# Altium project INVERTER_USE_555_IC.PrjPcb
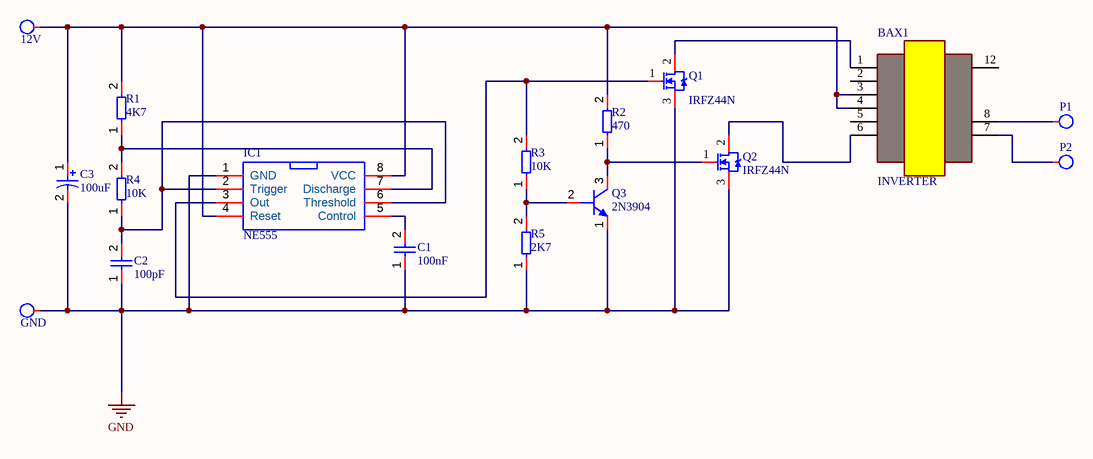
[diagram p0: INVERTER_USE_555_IC.SchDoc]
1 sheet, 17 parts. Net scope: global (net labels, ports and power ports of the same name join across sheets).
Board file: INVERTER_USE_555_IC.PcbDoc

## Sheet INVERTER_USE_555_IC.SchDoc
size A4; SheetNumber: 1; SheetTotal: 1

### Parts
12V  SolderPoint  [SolderPoint]  (value not drawn)
BAX1  INVERTER  [BAX_INVERTER]
C1  100nF  [CAP_Ceramic_Disc_2]
C2  100pF  [CAP_Ceramic_Disc_2]
C3  100uF  [CAP_RAD_5mm]
GND  SolderPoint  [SolderPoint]  (value not drawn)
IC1  NE555  [N08E_TEX]
P1  SolderPoint  [SolderPoint]  (value not drawn)
P2  SolderPoint  [SolderPoint]  (value not drawn)
Q1  IRFZ44N  [TO-220A]
Q2  IRFZ44N  [TO-220A]
Q3  2N3904  [TO-92]
R1  4K7  [RES-0.25W-H-MF]
R2  470  [RES-0.25W-H-MF]
R3  10K  [RES-0.25W-H-MF]
R4  10K  [RES-0.25W-H-MF]
R5  2K7  [RES-0.25W-H-MF]

### Nets
GND: C1.1 C2.1 C3.2 GND.1 IC1.1(GND) Q1.3(S) Q2.3(S) Q3.1(E) R5.1
Net12V_1: 12V.1 BAX1.3 BAX1.4 C3.1 IC1.4(Reset) IC1.8(VCC) R1.2 R2.2
NetBAX1_1: BAX1.1 Q1.2(D)
NetBAX1_6: BAX1.6 Q2.2(D)
NetBAX1_7: BAX1.7 P2.1
NetBAX1_8: BAX1.8 P1.1
NetC1_2: C1.2 IC1.5(Control)
NetC2_2: C2.2 IC1.2(Trigger) IC1.6(Threshold) R4.1
NetIC1_3: IC1.3(Out) Q1.1(G) R3.2
NetIC1_7: IC1.7(Discharge) R1.1 R4.2
NetQ2_1: Q2.1(G) Q3.3(C) R2.1
NetQ3_2: Q3.2(B) R3.1 R5.2

Not connected (* = marked no-connect by the designer): BAX1 2 5 12

### Library data of the parts
BAX1 = BAX_INVERTER
C1 C2 = Capacitors(Disc)
C3 = Capacitor(Radian)
Q3 = 2N3904 (TO-92)
R1-R5 = Resistors THD